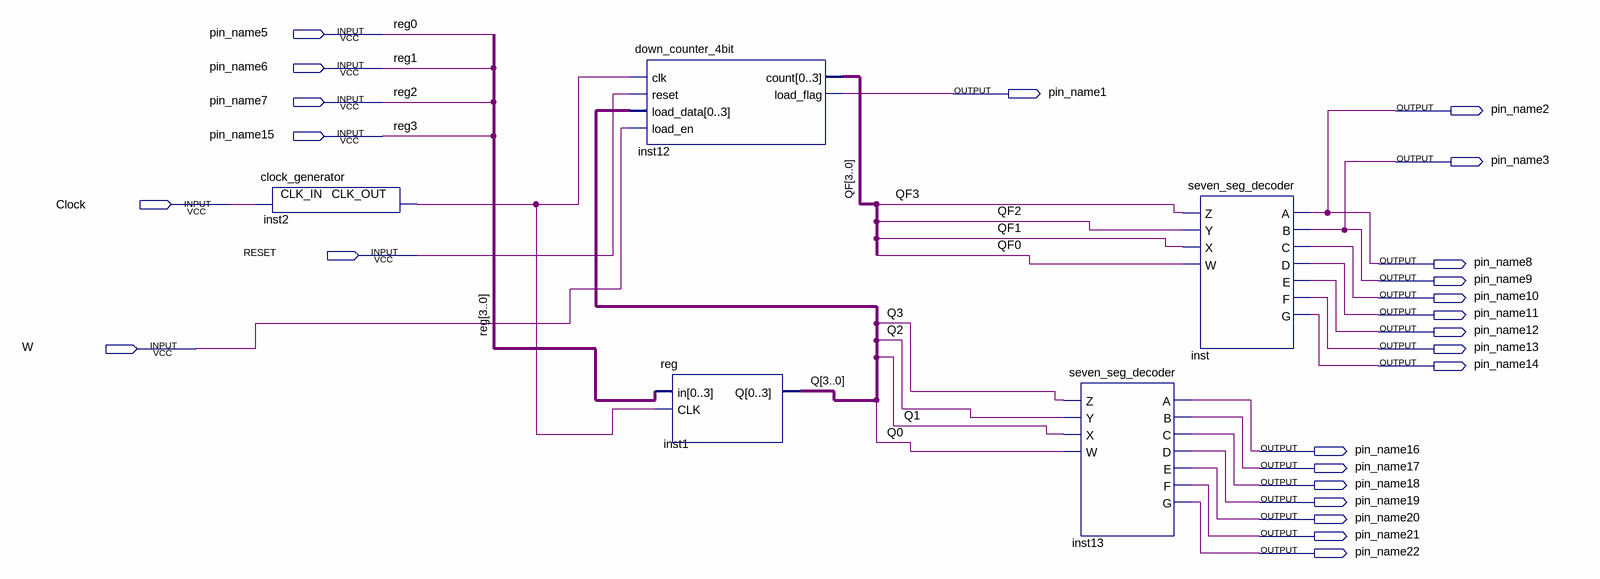
[diagram p0: schematic sheet]
// Quartus schematic finalproj.bdf as structural Verilog: 5 symbols, 24 pins
module finalproj (
  input  pin_name5,
  input  pin_name6,
  input  pin_name7,
  input  pin_name15,
  input  Clock,
  input  RESET,
  input  W,
  output pin_name1,
  output pin_name2,
  output pin_name3,
  output pin_name8,
  output pin_name9,
  output pin_name10,
  output pin_name11,
  output pin_name12,
  output pin_name13,
  output pin_name14,
  output pin_name16,
  output pin_name17,
  output pin_name18,
  output pin_name19,
  output pin_name20,
  output pin_name21,
  output pin_name22
);

  wire inst2_clk_out;
  wire [3:0] Q, QF;

  clock_generator inst2 (.CLK_IN(Clock), .CLK_OUT(inst2_clk_out));
  down_counter_4bit inst12 (
    .clk(inst2_clk_out), .reset(RESET), .load_data(Q), .load_en(W), .count(QF), .load_flag(pin_name1));
  \reg  inst1 (.in({pin_name15, pin_name7, pin_name6, pin_name5}), .CLK(inst2_clk_out), .Q(Q));
  seven_seg_decoder inst13 (
    .Z(Q[3]), .Y(Q[2]), .X(Q[1]), .W(Q[0]), .A(pin_name16), .B(pin_name17), .C(pin_name18), .D(pin_name19),
    .E(pin_name20), .F(pin_name21), .G(pin_name22));
  seven_seg_decoder inst (
    .Z(QF[3]), .Y(QF[2]), .X(QF[1]), .W(QF[0]), .A(pin_name2), .B(pin_name3), .C(pin_name10), .D(pin_name11),
    .E(pin_name12), .F(pin_name13), .G(pin_name14));

  assign pin_name8 = pin_name2;
  assign pin_name9 = pin_name3;

  // Other names for the same wires on the sheet: reg[3:0] = {pin_name15, pin_name7, pin_name6, pin_name5};
  //   reg0 = pin_name5; reg1 = pin_name6; reg2 = pin_name7; reg3 = pin_name15
endmodule
